# Altium project BMS.PrjPcb (part 1 of 2)
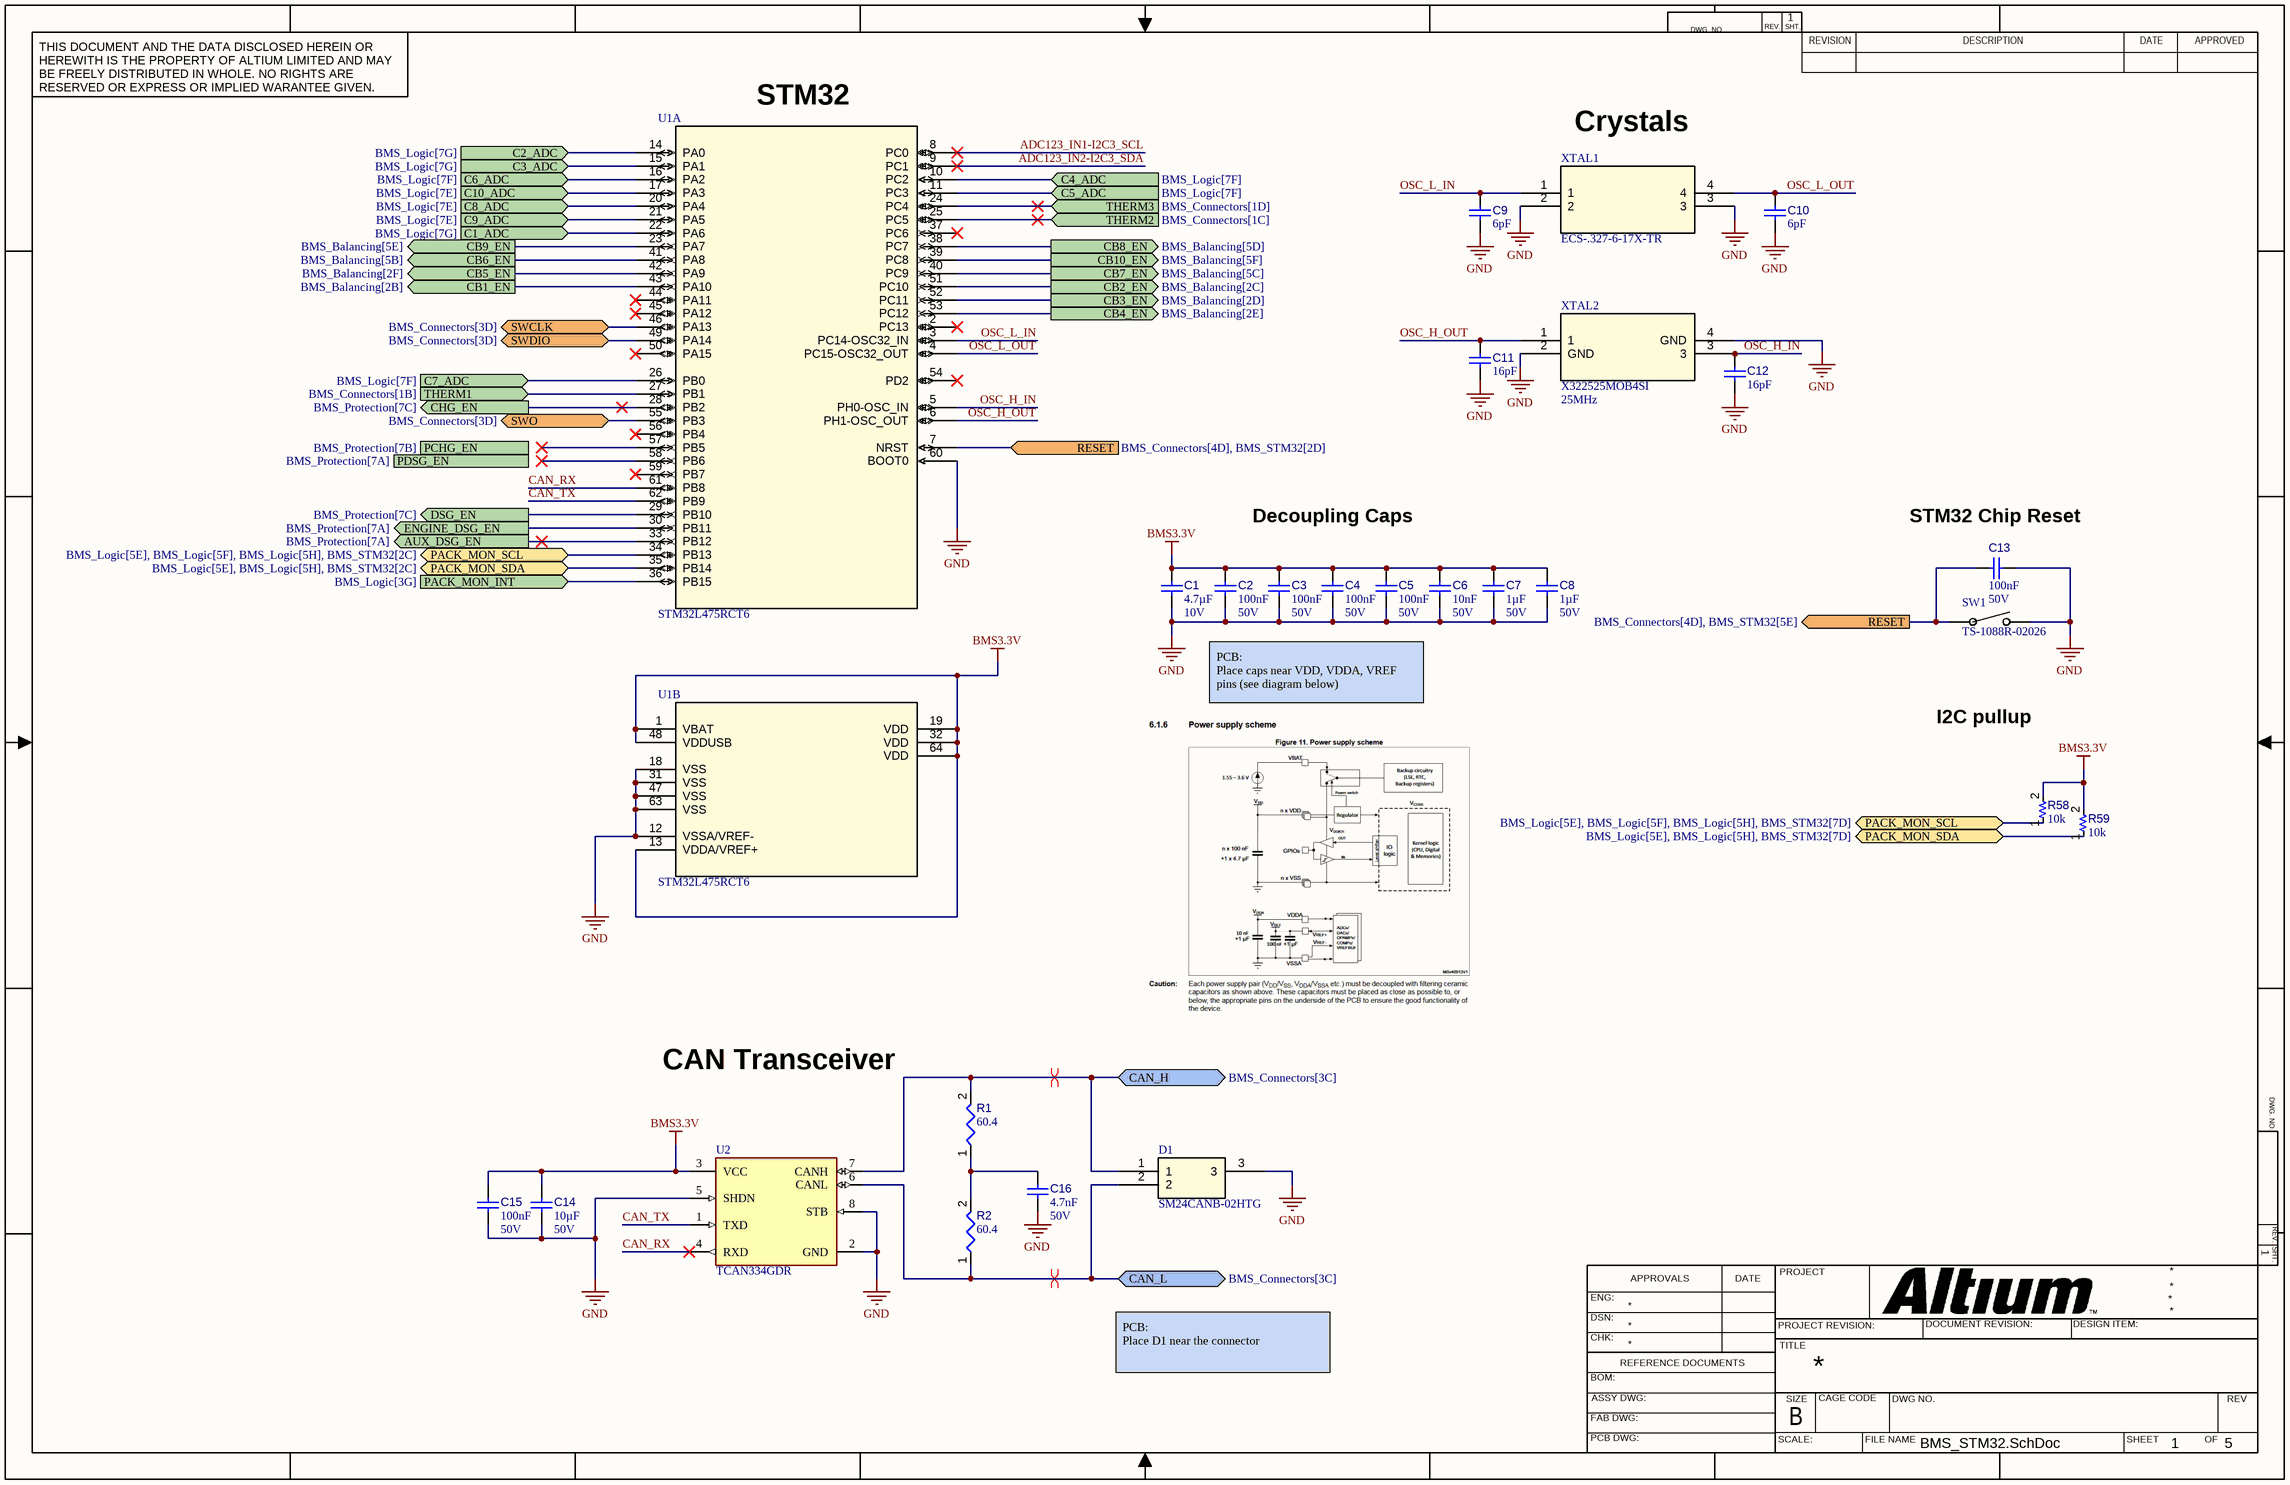
[diagram p0: BMS_STM32.SchDoc]
6 sheets, 209 parts. Net scope: flat (ports and power ports of the same name join across sheets).
Board file: BMS.PcbDoc
Sheets:
  BMS_STM32.SchDoc
  BMS_Connectors.SchDoc
  BMS_PowerRegulation.SchDoc
  BMS_Logic.SchDoc
  BMS_Balancing.SchDoc
  BMS_Protection.SchDoc

## Sheet BMS_STM32.SchDoc
size 431 x 279 mm; SheetNumber: 1; SheetTotal: 5

### Parts
C1  value 4.7µF  Voltage Rating: 10V  [CAPC0603(1608)100_L]  (hidden comment: Capacitor 4.7µF +/-20% 10V 0603)
C2  value 100nF  Voltage Rating: 50V  [CAPC0402(1005)60_L]  (hidden comment: Capacitor 100nF +/-20% 50V 0402)
C3  value 100nF  Voltage Rating: 50V  [CAPC0402(1005)60_L]  (hidden comment: Capacitor 100nF +/-20% 50V 0402)
C4  value 100nF  Voltage Rating: 50V  [CAPC0402(1005)60_L]  (hidden comment: Capacitor 100nF +/-20% 50V 0402)
C5  value 100nF  Voltage Rating: 50V  [CAPC0402(1005)60_L]  (hidden comment: Capacitor 100nF +/-20% 50V 0402)
C6  value 10nF  Voltage Rating: 50V  [CAPC0402(1005)60_L]  (hidden comment: Capacitor 10nF +/-20% 50V 0402)
C7  value 1µF  Voltage Rating: 50V  [CAPC0603(1608)100_L]  (hidden comment: Capacitor 1µF +/-40% 50V 0603)
C8  value 1µF  Voltage Rating: 50V  [CAPC0603(1608)100_L]  (hidden comment: Capacitor 1µF +/-40% 50V 0603)
C9  value 6pF  [CAPC1709X04N]  (hidden comment: Yageo CC0603CRNPO9BN6R0)
C10  value 6pF  [CAPC1709X04N]  (hidden comment: Yageo CC0603CRNPO9BN6R0)
C11  value 16pF  [CAPC1709X04N]  (hidden comment: Yageo CC0603JRNPO9BN160)
C12  value 16pF  [CAPC1709X04N]  (hidden comment: Yageo CC0603JRNPO9BN160)
C13  value 100nF  Voltage Rating: 50V  [CAPC0402(1005)60_L]  (hidden comment: Capacitor 100nF +/-20% 50V 0402)
C14  value 10µF  Voltage Rating: 50V  [CAPC0805(2012)145_L]  (hidden comment: Samsung Electro-Mechanics CL21A106KBYQNNE)
C15  value 100nF  Voltage Rating: 50V  [CAPC0402(1005)60_L]  (hidden comment: Capacitor 100nF +/-20% 50V 0402)
C16  value 4.7nF  Voltage Rating: 50V  [CAPC1709X04N]  (hidden comment: yageo CC0603KRX7R9BB472)
D1  SM24CANB-02HTG  [SOT23-3_SM24CANB-02HTG_LTF]
R1  value 60.4  [RESC1709X04N]  (hidden comment: yageo RC0603FR-0760R4L)
R2  value 60.4  [RESC1709X04N]  (hidden comment: yageo RC0603FR-0760R4L)
R58  value 10k  [RESC0402(1005)_L]  (hidden comment: RC0402FR-0710KL)
R59  value 10k  [RESC0402(1005)_L]  (hidden comment: RC0402FR-0710KL)
SW1  TS-1088R-02026  [SW_TS-1088R-02026_XNP]
U1  STM32L475RCT6  [LQFP64-10x10mm]  (parts A,B of 2)
U2  TCAN334GDR  [FP-D0008A-IPC_B]
XTAL1  ECS-.327-6-17X-TR  [XTAL_7X-TR_ECS]
XTAL2  X322525MOB4SI  Frequency: 25MHz  [SMT_MOB4SI_YXC]

### Ports
AUX_DSG_EN (out, see BMS_Protection[7A]), C1_ADC (in, see BMS_Logic[7G]), C2_ADC (in, see BMS_Logic[7G]), C3_ADC (in, see BMS_Logic[7G]), C4_ADC (in, see BMS_Logic[7F]), C5_ADC (in, see BMS_Logic[7F]), C6_ADC (in, see BMS_Logic[7F]), C7_ADC (in, see BMS_Logic[7F]), C8_ADC (in, see BMS_Logic[7E]), C9_ADC (in, see BMS_Logic[7E]), C10_ADC (in, see BMS_Logic[7E]), CAN_H (bidir, see BMS_Connectors[3C]), CAN_L (bidir, see BMS_Connectors[3C]), CB1_EN (out, see BMS_Balancing[2B]), CB2_EN (out, see BMS_Balancing[2C]), CB3_EN (out, see BMS_Balancing[2D]), CB4_EN (out, see BMS_Balancing[2E]), CB5_EN (out, see BMS_Balancing[2F]), CB6_EN (out, see BMS_Balancing[5B]), CB7_EN (out, see BMS_Balancing[5C]), CB8_EN (out, see BMS_Balancing[5D]), CB9_EN (out, see BMS_Balancing[5E]), CB10_EN (out, see BMS_Balancing[5F]), CHG_EN (out, see BMS_Protection[7C]), DSG_EN (out, see BMS_Protection[7C]), ENGINE_DSG_EN (out, see BMS_Protection[7A]), PACK_MON_INT (in, see BMS_Logic[3G]), PACK_MON_SCL (bidir, see BMS_Logic[5E], BMS_Logic[5F], BMS_Logic[5H], BMS_STM32[2C]), PACK_MON_SCL (bidir, see BMS_Logic[5E], BMS_Logic[5F], BMS_Logic[5H], BMS_STM32[7D]), PACK_MON_SDA (bidir, see BMS_Logic[5E], BMS_Logic[5H], BMS_STM32[2C]), PACK_MON_SDA (bidir, see BMS_Logic[5E], BMS_Logic[5H], BMS_STM32[7D]), PCHG_EN (out, see BMS_Protection[7B]), PDSG_EN (out, see BMS_Protection[7A]), RESET (in, see BMS_Connectors[4D], BMS_STM32[2D]), RESET (out, see BMS_Connectors[4D], BMS_STM32[5E]), SWCLK (bidir, see BMS_Connectors[3D]), SWDIO (bidir, see BMS_Connectors[3D]), SWO (bidir, see BMS_Connectors[3D]), THERM1 (in, see BMS_Connectors[1B]), THERM2 (in, see BMS_Connectors[1C]), THERM3 (in, see BMS_Connectors[1D])

### Nets
BMS3.3V: C1.1 C2.2 C3.2 C4.2 C5.2 C6.1 C7.1 C8.1 C14.1 C15.1 R58.2 R59.2 U1.1(VBAT) U1.13(VDDA/VREF+) U1.19(VDD) U1.32(VDD) U1.48(VDDUSB) U1.64(VDD) U2.3(VCC)
GND: C1.2 C2.1 C3.1 C4.1 C5.1 C6.2 C7.2 C8.2 C9.2 C10.2 C11.2 C12.1 C13.1 C14.2 C15.2 C16.2 D1.3 SW1.2 U1.12(VSSA/VREF-) U1.18(VSS) U1.31(VSS) U1.47(VSS) U1.60(BOOT0) U1.63(VSS) U2.2(GND) U2.5(SHDN) U2.8(STB) XTAL1.2 XTAL1.3 XTAL2.2(GND) XTAL2.4(GND)
ADC123_IN1-I2C3_SCL: U1.8(PC0)
ADC123_IN2-I2C3_SDA: U1.9(PC1)
AUX_DSG_EN: U1.33(PB12) ; port AUX_DSG_EN
C1_ADC: U1.22(PA6) ; port C1_ADC
C2_ADC: U1.14(PA0) ; port C2_ADC
C3_ADC: U1.15(PA1) ; port C3_ADC
C4_ADC: U1.10(PC2) ; port C4_ADC
C5_ADC: U1.11(PC3) ; port C5_ADC
C6_ADC: U1.16(PA2) ; port C6_ADC
C7_ADC: U1.26(PB0) ; port C7_ADC
C8_ADC: U1.20(PA4) ; port C8_ADC
C9_ADC: U1.21(PA5) ; port C9_ADC
C10_ADC: U1.17(PA3) ; port C10_ADC
CAN_H: D1.1 R1.2 U2.7(CANH) ; port CAN_H
CAN_L: D1.2 R2.1 U2.6(CANL) ; port CAN_L
CAN_RX: U1.61(PB8) U2.4(RXD)
CAN_TX: U1.62(PB9) U2.1(TXD)
CB1_EN: U1.43(PA10) ; port CB1_EN
CB2_EN: U1.51(PC10) ; port CB2_EN
CB3_EN: U1.52(PC11) ; port CB3_EN
CB4_EN: U1.53(PC12) ; port CB4_EN
CB5_EN: U1.42(PA9) ; port CB5_EN
CB6_EN: U1.41(PA8) ; port CB6_EN
CB7_EN: U1.40(PC9) ; port CB7_EN
CB8_EN: U1.38(PC7) ; port CB8_EN
CB9_EN: U1.23(PA7) ; port CB9_EN
CB10_EN: U1.39(PC8) ; port CB10_EN
CHG_EN: U1.28(PB2) ; port CHG_EN
DSG_EN: U1.29(PB10) ; port DSG_EN
ENGINE_DSG_EN: U1.30(PB11) ; port ENGINE_DSG_EN
OSC_H_IN: C12.2 U1.5(PH0-OSC_IN) XTAL2.3
OSC_H_OUT: C11.1 U1.6(PH1-OSC_OUT) XTAL2.1
OSC_L_IN: C9.1 U1.3(PC14-OSC32_IN) XTAL1.1
OSC_L_OUT: C10.1 U1.4(PC15-OSC32_OUT) XTAL1.4
PACK_MON_INT: U1.36(PB15) ; port PACK_MON_INT
PACK_MON_SCL: R58.1 U1.34(PB13) ; port PACK_MON_SCL
PACK_MON_SDA: R59.1 U1.35(PB14) ; port PACK_MON_SDA
RESET: C13.2 SW1.1 U1.7(NRST) ; port RESET
SWCLK: U1.46(PA13) ; port SWCLK
SWDIO: U1.49(PA14) ; port SWDIO
SWO: U1.55(PB3) ; port SWO
THERM1: U1.27(PB1) ; port THERM1
THERM2: U1.25(PC5) ; port THERM2
THERM3: U1.24(PC4) ; port THERM3
NetC16_1: C16.1 R1.1 R2.2

Not connected (* = marked no-connect by the designer): U1 2(PC13)* 37(PC6)* 44(PA11)* 45(PA12)* 50(PA15)* 54(PD2)* 56(PB4)* 57(PB5)* 58(PB6)* 59(PB7)*

### Layout directives
differential pair: CAN_H, CAN_L

### Notes on the sheet
- (near U1) STM32
- Crystals
- Decoupling Caps
- (near C13) STM32 Chip Reset
- PCB:
  Place caps near VDD, VDDA, VREF pins (see diagram below)
- I2C pullup
- CAN Transceiver
- PCB:
  Place D1 near the connector
- DWG. NO.
- REV.
- SHT.
- THIS DOCUMENT AND THE DATA DISCLOSED HEREIN OR HEREWITH IS THE PROPERTY OF ALTIUM LIMITED AND MAY BE FREELY DISTRIBUTED IN WHOLE. NO RIGHTS ARE RESERVED OR EXPRESS OR IMPLIED WARANTEE GIVEN.
- REVISION
- DESCRIPTION
- DATE
- APPROVED
- ENG:
- APPROVALS
- PROJECT
- DSN:
- CHK:
- REFERENCE DOCUMENTS
- PROJECT REVISION:
- TITLE
- DOCUMENT REVISION:
- DESIGN ITEM:
- BOM:
- FAB DWG:
- PCB DWG:
- ASSY DWG:
- SCALE:
- SIZE
- B
- CAGE CODE
- FILE NAME
- DWG NO.
- SHEET
- OF
- REV

### Library data of the parts
C1 = CMP-001-00076-4: Chip Capacitor, 4.7µF +/-20%, 10V, 0603, Thickness 1 mm; Tolerance: 10%; Mounting Technology: SMT; Case/Package: 0603; Pins: 2; Min Operating Temperature: -55°C; Max Operating Temperature: 85°C
C2-C5 C13 C15 = CMP-001-00067-3: Chip Capacitor, 100nF +/-20%, 50V, 0402, Thickness 0.6 mm; Tolerance: 10%; Min Operating Temperature: -55°C; Pins: 2; Case/Package: 0402; Max Operating Temperature: 85°C; Mounting Technology: SMT
C6 = CMP-001-00069-3: Chip Capacitor, 10nF +/-20%, 50V, 0402, Thickness 0.6 mm; Tolerance: 5%; Max Operating Temperature: 85°C; Pins: 2; Case/Package: 0402; Min Operating Temperature: -55°C; Mounting Technology: SMT
C7 C8 = CMP-001-00078-4: Chip Capacitor, 1µF +/-40%, 50V, 0603, Thickness 1 mm; Tolerance: 10%; Case/Package: 0603; Pins: 2; Max Operating Temperature: 85°C; Mounting Technology: SMT; Min Operating Temperature: -55°C
C9 C10 = CMP-001-00085-2: Ceramic Capacitor, Multilayer, Ceramic, 50V, 4.17% +Tol, 4.17% -Tol, C0G, -/+30ppm/Cel TC, 0.000006uF, Surface Mount, 0603; Pins: 2; Capacitor Type: Ceramic; Case/Package: 0603; Mounting Technology: Surface Mount; RoHS Compliant: Yes; Min Operating Temperature: -55°C; Max Operating Temperature: 125°C
C11 C12 = CMP-001-00087-3: Multilayer Ceramic Capacitor, 16 pF, 50 V, ± 5%, C0G (NP0), 0603 [1608 Metric]
C14 = CMP-001-00079-4: Chip Capacitor, 10µF +/-20%, 25V, 0805, Thickness 1.45 mm; Tolerance: 10%; Max Operating Temperature: 85°C; Case/Package: 0805; Min Operating Temperature: -55°C; Mounting Technology: SMT; Pins: 2
C16 = CMP-001-00083-3: Ceramic Capacitor, Multilayer, Ceramic, 50V, 10% +Tol, 10% -Tol, X7R, 15% TC, 0.0047uF, Surface Mount, 0603; Max Operating Temperature: 125°C; RoHS Compliant: Yes; Case/Package: 0603; Mounting Technology: Surface Mount; Pins: 2; Capacitor Type: Ceramic; Min Operating Temperature: -55°C
D1 = CMP-054-000000-3: No Description Available; Manufacturer_Name: Littelfuse Inc; Source: SM24CANB-02HTG.SchLib; Manufacturer_Part_Number: SM24CANB-02HTG; Design Item ID: SM24CANB-02HTG; RefDes: RefDes; Copyright: Copyright (C) 2025 Ultra Librarian. All rights reserved.; Type: Type
R1 R2 = CMP-009-00177-3: Fixed Resistor, Metal Glaze/thick Film, 0.1W, 60.4ohm, 75V, 1% +/-Tol, 100ppm/Cel, Surface Mount, 0603; Power: 100mW; Max Operating Temperature: 155°C; Pins: 2; Tolerance: 1%; RoHS Compliant: Yes; Min Operating Temperature: -55°C; Mounting Technology: Surface Mount; Case/Package: 0603
R58 R59 = CMP-009-00065-4: 100R 0.063W 1% 0402 (1005 Metric)  SMD; Power: 63mW; Mounting Technology: SMT; Case/Package: 0402; Pins: 2; Tolerance: 1%
SW1 = CMP-011-00013-1: No Description Available; Manufacturer_Name: Xunpu; Design Item ID: TS-1088R-02026; Copyright: Copyright (C) 2025 Ultra Librarian. All rights reserved.; Manufacturer_Part_Number: TS-1088R-02026; Type: Tactile Switches; Source: TS-1088R-02026.SchLib
U1 = CMP-031-00008-2: Ultra-low-power with FPU Arm Cortex-M4 MCU 80 MHz with 256 Kbytes of Flash memory, USB OTG, DFSDM; Manufacturer_Name: STMicroelectronics; Design Item ID: STM32L475RCT6; Manufacturer_Part_Number: STM32L475RCT6; Source: STM32L475RCT6.SchLib; RefDes: RefDes; Copyright: Copyright (C) 2025 Ultra Librarian. All rights reserved.; Type: Type; Datasheet: https://www.st.com/resource/en/datasheet/stm32l475rc.pdf; RoHS Compliant: Yes
U2 = CMP-015-00009-1: Interface Circuit, PDSO8; Nominal Supply Voltage: 3.3V; Min Operating Temperature: -40°C; RoHS Compliant: Yes; Max Operating Temperature: 125°C; Pins: 8; Case/Package: SOP
XTAL1 = CMP-036-000000-1: No Description Available; Manufacturer_Name: ECS International; Copyright: Copyright (C) 2025 Ultra Librarian. All rights reserved.; Manufacturer_Part_Number: ECS-.327-6-17X-TR; Design Item ID: ECS-.327-6-17X-TR; Source: ECS-P327-6-17X-TR.SchLib; RefDes: RefDes; Type: Type
XTAL2 = CMP-039-000000-5: No Description Available; Manufacturer_Name: YXC; Design Item ID: X322525MOB4SI; Copyright: Copyright (C) 2025 Ultra Librarian. All rights reserved.; Source: X322525MOB4SI.SchLib; Type: Type; RefDes: RefDes; Manufacturer_Part_Number: X322525MOB4SI

## Sheet BMS_Connectors.SchDoc: Connectors
size A4; SheetNumber: 2; SheetTotal: 5
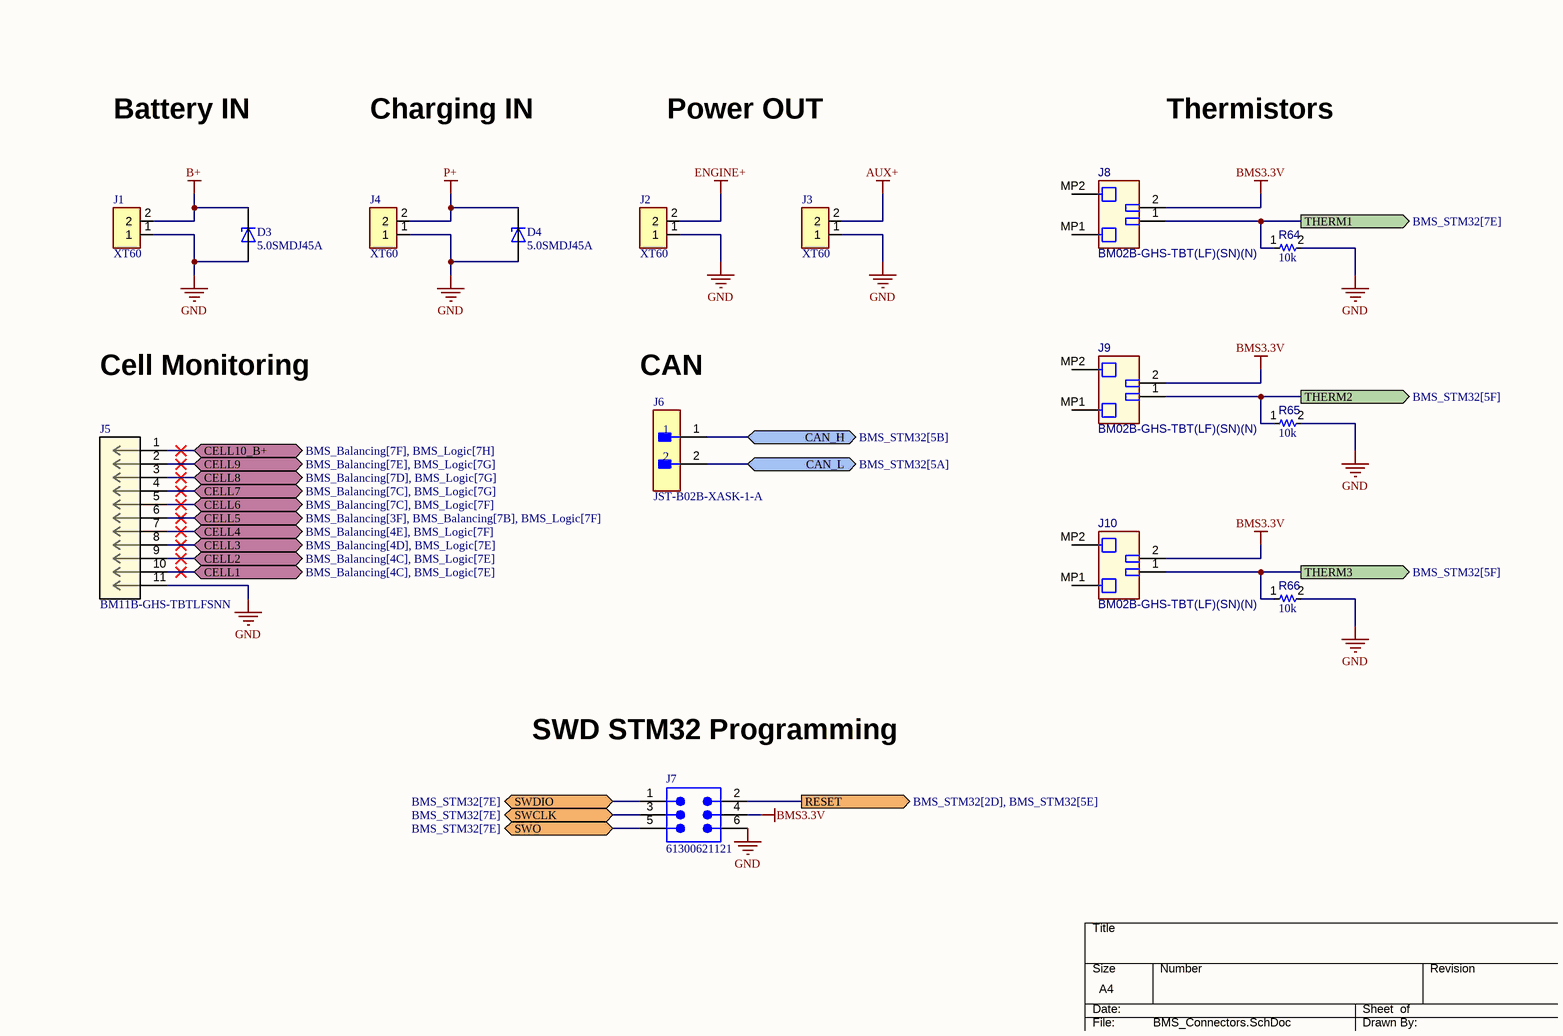
[diagram p1: BMS_Connectors.SchDoc]

### Parts
D3  5.0SMDJ45A  [DIOM7959X262N]
D4  5.0SMDJ45A  [DIOM7959X262N]
J1  XT60  [AMASS_XT60PB-M]
J2  XT60  [AMASS_XT60PB-M]
J3  XT60  [AMASS_XT60PB-M]
J4  XT60  [AMASS_XT60PB-M]
J5  BM11B-GHS-TBTLFSNN  [CONN11_BM11B-GHS-TBTLFSNN_JST]
J6  JST-B02B-XASK-1-A  [FP-B02B-XASK-1-A_LF_SN-MFG]
J7  61300621121  [61300621121]
J8  BM02B-GHS-TBT(LF)(SN)(N)  [JST-BM02B-GHS-TBT_V]
J9  BM02B-GHS-TBT(LF)(SN)(N)  [JST-BM02B-GHS-TBT_V]
J10  BM02B-GHS-TBT(LF)(SN)(N)  [JST-BM02B-GHS-TBT_V]
R64  value 10k  [RESC0402(1005)_L]  (hidden comment: RC0402FR-0710KL)
R65  value 10k  [RESC0402(1005)_L]  (hidden comment: RC0402FR-0710KL)
R66  value 10k  [RESC0402(1005)_L]  (hidden comment: RC0402FR-0710KL)

### Ports
CAN_H (bidir, see BMS_STM32[5B]), CAN_L (bidir, see BMS_STM32[5A]), CELL1 (bidir, see BMS_Balancing[4C], BMS_Logic[7E]), CELL2 (bidir, see BMS_Balancing[4C], BMS_Logic[7E]), CELL3 (bidir, see BMS_Balancing[4D], BMS_Logic[7E]), CELL4 (bidir, see BMS_Balancing[4E], BMS_Logic[7F]), CELL5 (bidir, see BMS_Balancing[3F], BMS_Balancing[7B], BMS_Logic[7F]), CELL6 (bidir, see BMS_Balancing[7C], BMS_Logic[7F]), CELL7 (bidir, see BMS_Balancing[7C], BMS_Logic[7G]), CELL8 (bidir, see BMS_Balancing[7D], BMS_Logic[7G]), CELL9 (bidir, see BMS_Balancing[7E], BMS_Logic[7G]), CELL10_B+ (bidir, see BMS_Balancing[7F], BMS_Logic[7H]), RESET (out, see BMS_STM32[2D], BMS_STM32[5E]), SWCLK (bidir, see BMS_STM32[7E]), SWDIO (bidir, see BMS_STM32[7E]), SWO (bidir, see BMS_STM32[7E]), THERM1 (out, see BMS_STM32[7E]), THERM2 (out, see BMS_STM32[5F]), THERM3 (out, see BMS_STM32[5F])

### Nets
AUX+: J3.2
B+: D3.C J1.2 J5.1 ; port CELL10_B+
BMS3.3V: J7.4 J8.2 J9.2 J10.2
ENGINE+: J2.2
GND: D3.A D4.A J1.1 J2.1 J3.1 J4.1 J5.11 J7.6 R64.2 R65.2 R66.2
P+: D4.C J4.2
CAN_H: J6.1 ; port CAN_H
CAN_L: J6.2 ; port CAN_L
CELL1: J5.10 ; port CELL1
CELL2: J5.9 ; port CELL2
CELL3: J5.8 ; port CELL3
CELL4: J5.7 ; port CELL4
CELL5: J5.6 ; port CELL5
CELL6: J5.5 ; port CELL6
CELL7: J5.4 ; port CELL7
CELL8: J5.3 ; port CELL8
CELL9: J5.2 ; port CELL9
RESET: J7.2 ; port RESET
SWCLK: J7.3 ; port SWCLK
SWDIO: J7.1 ; port SWDIO
SWO: J7.5 ; port SWO
THERM1: J8.1 R64.1 ; port THERM1
THERM2: J9.1 R65.1 ; port THERM2
THERM3: J10.1 R66.1 ; port THERM3

Not connected (* = marked no-connect by the designer): J8 MP1 MP2; J9 MP1 MP2; J10 MP1 MP2

### Notes on the sheet
- Battery IN
- Charging IN
- Power OUT
- Thermistors
- Cell Monitoring
- CAN
- SWD STM32 Programming
- DWG NO:
- REV:
- THIS DOCUMENT AND THE DATA DISCLOSED HEREIN OR
- HEREWITH IS THE PROPERTY OF ALTIUM LIMITED AND MAY
- BE FREELY DISTRIBUTED IN WHOLE. NO RIGHTS ARE
- RESERVED OR EXPRESS OR IMPLIED WARANTEE GIVEN.
- REVISION
- DESCRIPTION
- DATE
- APPROVED
- ENG:
- APPROVALS
- PROJECT
- DSN:
- CHK:
- REFERENCE DOCUMENTS
- PROJECT REVISION:
- TITLE
- DOCUMENT REVISION:
- DESIGN ITEM:
- BOM:
- FAB DWG:
- PCB DWG:
- ASSY DWG:
- SCALE:
- A2
- SIZE
- CAGE CODE
- FILE NAME
- DWG NO.
- SHEET
- OF
- REV

### Library data of the parts
D3 D4 = CMP-004-00034-2: 8.0SMDJ43CA-T7, Uni-Directional TVS Diode, 8000W, 2-Pin DO-214AB; MP: SMCJ48A; MF: Littelfuse Inc.; Design Item ID: 8.0SMDJ43CA-T7; SnapEDA_Link: https://www.snapeda.com/parts/SMCJ48A/Littelfuse/view-part/?ref=snap; Source: 8.0SMDJ43CA-T7.SchLib; Case/Package: DO-214 Littelfuse Inc.; Check_prices: https://www.snapeda.com/parts/SMCJ48A/Littelfuse/view-part/?ref=eda; Value: *
J1-J4 = CMP-011-000000-3: Power connector; 65A; PIN: 2; Colour: yellow; MF: Pololu; MP: XT60 YELLOW; Package: None; Availability: Not in stock; Check_prices: https://www.snapeda.com/parts/XT60%20YELLOW/Pololu/view-part/?ref=eda; Source: XT60_YELLOW.SchLib; Component Type: Standard; Value: *; SnapEDA_Link: https://www.snapeda.com/parts/XT60%20YELLOW/Pololu/view-part/?ref=snap; Price: None; Pin Count: 2; Design Item ID: XT60_YELLOW
J5 = CMP-168-000000-2: No Description Available; Manufacturer_Part_Number: BM11B-GHS-TBT(LF)(SN)(N); Manufacturer_Name: JST; RefDes: RefDes; Copyright: Copyright (C) 2025 Ultra Librarian. All rights reserved.; Design Item ID: BM11B-GHS-TBTLFSNN; Source: BM11B-GHS-TBTLFSNN.SchLib; Type: Type
J6 = CMP-002-00073-2: XA Series 2 Position 2.5mm Pitch Top Entry with Boss ThroughHole Shrouded Header
J7 = CMP-002-00076-2: WR-PHD Pin Header, THT, Vertical, pitch 2.54mm, 2 Row, 6P; Manufacturer: Wurth Elektronik; Contact Resistance: 20mOhm; Withstanding Voltage: 500V; Working Voltage: 250V; Rated Current: 3A; ComponentLink2URL: https://www.we-online.com/redexpert/spec/61300621121?ad; Operating Temperature Max: 105°C; Operating Temperature Min: -40°C; Match Code: WR-PHD; Pins: 6; Source: WR-PHD.SchLib; ComponentLink1URL: https://www.we-online.com/redexpert/article/61300621121?ad; Mount: Through Hole; Design Item ID: 61300621121; Orientation: Vertical; Manufacturer Part Number: 61300621121; Category: Board-to-Board Connectors; Pitch: 2.54mm; ComponentLink2Description: Datasheet Link; Packaging: Bag; Gender: Pin Header; ComponentLink1Description: Website Link; Pin Count: 6; Component Type: Standard; Number of Rows: 2
J8-J10 = CMP-002-00061-3: Disconnectable Crimp Style Connector, Pitch 1.25 mm, 1 x 2 Position, Height 4.05 mm, -25 to 85 degC, RoHS, Tape and Reel; Connector Type: Header,Shrouded; Mounting Technology: SurfaceMount; Case/Package: Disconnectable Crimp Style Connector, Pitch 1.25 mm, 1 x 2 Position, Height 4.05 mm; Pins: 4
R64-R66 = CMP-009-00065-4: as R58 on sheet BMS_STM32; Mounting Technology: SMT; Case/Package: 0402; Pins: 2; Tolerance: 1%

## Sheet BMS_PowerRegulation.SchDoc
size 431 x 279 mm; SheetNumber: 3; SheetTotal: 5
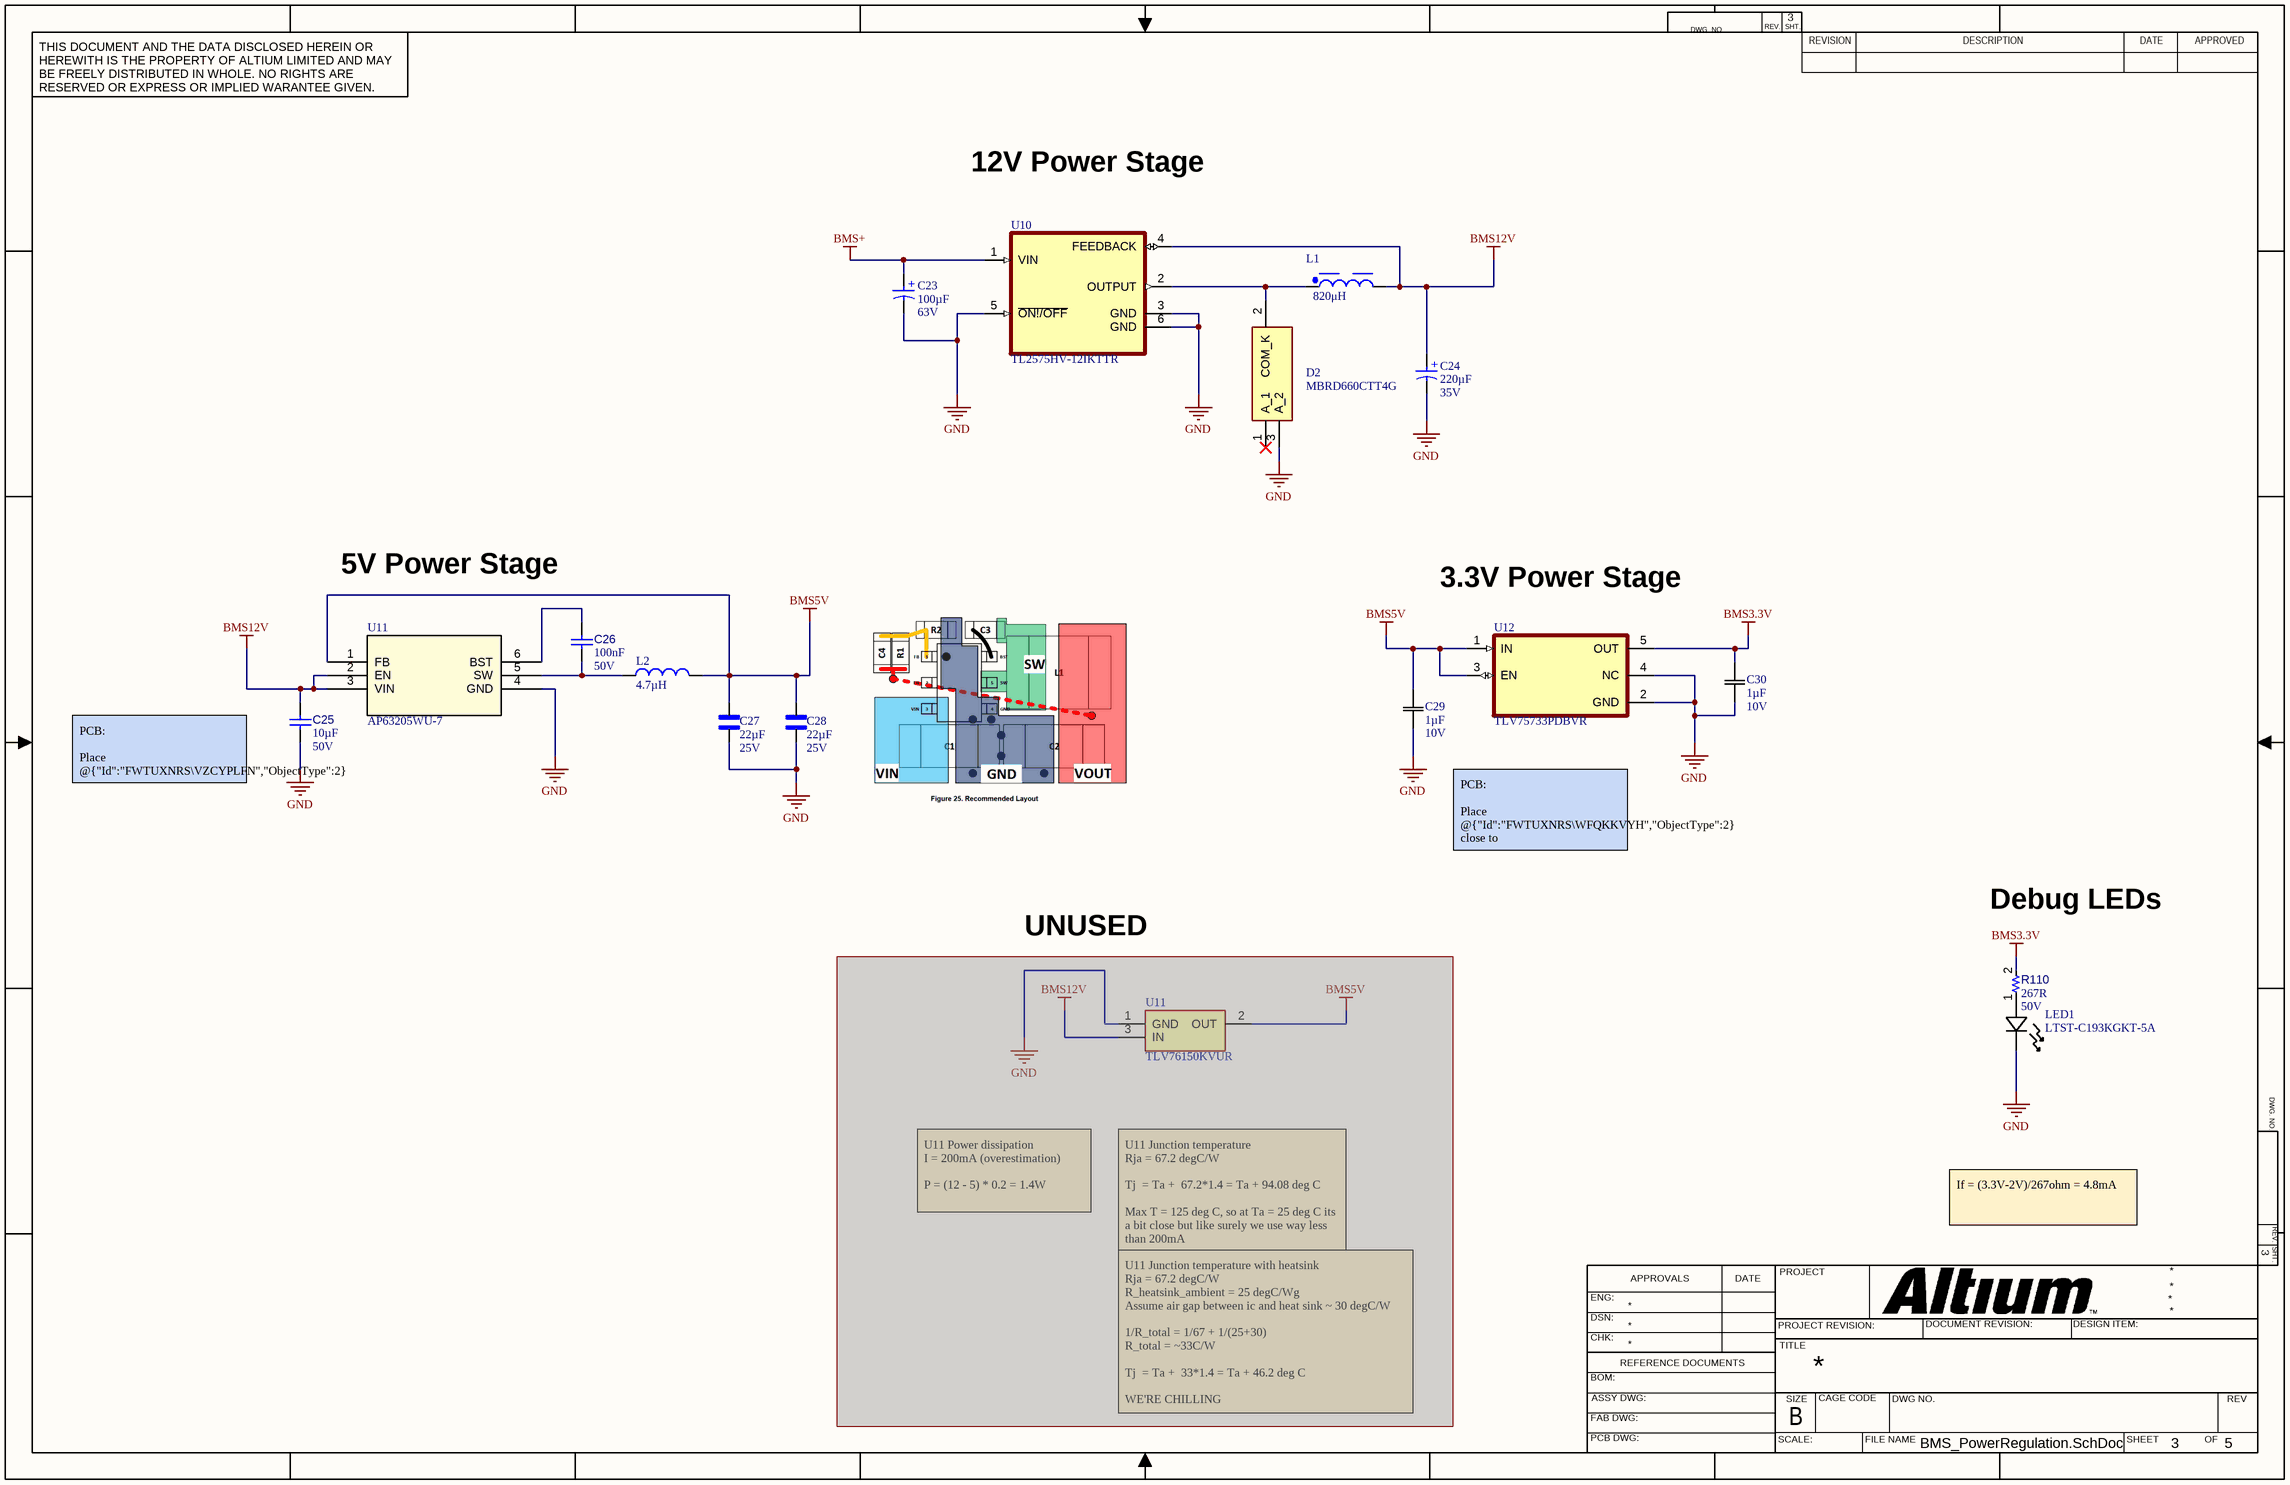
[diagram p2: BMS_PowerRegulation.SchDoc]

### Parts
(Parts that share a designator on the sheet are numbered #1, #2 ... from top to bottom, then left to right.)
C23  value 100µF  Rated Voltage (DC): 63V  [WCAP-ASLI_D10H10.5]  (hidden comment: 865080757014)
C24  value 220µF  Rated Voltage (DC): 35V  [WCAP-ASLI_D8H10.5]  (hidden comment: 865080553014)
C25  value 10µF  Voltage Rating: 50V  [CAPC0805(2012)145_L]  (hidden comment: Samsung Electro-Mechanics CL21A106KBYQNNE)
C26  value 100nF  Voltage Rating: 50V  [CAPC0402(1005)60_L]  (hidden comment: Capacitor 100nF +/-20% 50V 0402)
C27  value 22µF  Voltage Rating: 25V  [CAPC2012X145N]  (hidden comment: CL21A226MAYNNNE)
C28  value 22µF  Voltage Rating: 25V  [CAPC2012X145N]  (hidden comment: CL21A226MAYNNNE)
C29  value 1µF  Voltage Rating: 10V  [CAP_CL10_SAM]  (hidden comment: CL10B105KP8NNNC)
C30  value 1µF  Voltage Rating: 10V  [CAP_CL10_SAM]  (hidden comment: CL10B105KP8NNNC)
D2  MBRD660CTT4G  [MBRD660CTT4G]
L1  Inductance: 820μH  [WE-PD_1210]  (hidden comment: 7447709821 820uH)
L2  value 4.7µH  [INDC2520X100N]  (hidden comment: LQM2HPN4R7MG0L)
LED1  LTST-C193KGKT-5A  [LED_LTST-C194K-0603_1P6X0P8X0P3_LTO]
R110  value 267R  Voltage Rating: 50V  [RESC0402(1005)_L]  (hidden comment: RT0402BRD07267RL)
U10  TL2575HV-12IKTTR  [VREG_TPS79625KTTR]
U11#1  AP63205WU-7  [SOIC_05WU-7_DIO]
U11#2  TLV76150KVUR  [TLV76150KVUR_WithHeatsink]  (masked out: inside a compile mask, not in the netlist)
U12  TLV75733PDBVR  [SOT95P280X145-5N]

### Nets
BMS3.3V: C30.2 R110.2 U12.5(OUT)
BMS5V: C27.2 C28.2 C29.2 L2.2 U11#1.1(FB) U12.1(IN) U12.3(EN)
BMS12V: C24.1(P) C25.1 L1.2 U10.4(FEEDBACK) U11#1.2(EN) U11#1.3(VIN)
BMS+: C23.1(P) U10.1(VIN)
GND: C23.2(N) C24.2(N) C25.2 C27.1 C28.1 C29.1 C30.1 D2.3(A_2) LED1.1 U10.3(GND) U10.5(~{ON!/OFF}) U10.6(GND) U11#1.4(GND) U12.2(GND) U12.4(NC)
NetC26_1: C26.1 L2.1 U11#1.5(SW)
NetC26_2: C26.2 U11#1.6(BST)
NetD2_2: D2.2(COM_K) L1.1 U10.2(OUTPUT)
NetLED1_2: LED1.2 R110.1

Not connected (* = marked no-connect by the designer): D2 1(A_1)*

### Notes on the sheet
- 12V Power Stage
- 5V Power Stage
- 3.3V Power Stage
- PCB:
  Place @{"Id":"FWTUXNRS\VZCYPLFN","ObjectType":2} close to @{"Id":"FWTUXNRS\CUETEAYZ","ObjectType":2} pin 3
- PCB:
  Place @{"Id":"FWTUXNRS\WFQKKVYH","ObjectType":2} close to @{"Id":"FWTUXNRS\HPDKJLBX","ObjectType":2} pin 1
  Place @{"Id":"FWTUXNRS\TOYSBIWG","ObjectType":2} close to @{"Id":"FWTUXNRS\HPDKJLBX","ObjectType":2} pin 5
- UNUSED
- Debug LEDs
- U11 Power dissipation
  I = 200mA (overestimation)
  P = (12 - 5) * 0.2 = 1.4W
- If = (3.3V-2V)/267ohm = 4.8mA
- U11 Junction temperature
  Rja = 67.2 degC/W
  Tj  = Ta +  67.2*1.4 = Ta + 94.08 deg C
  Max T = 125 deg C, so at Ta = 25 deg C its a bit close but like surely we use way less than 200mA
- U11 Junction temperature with heatsink
  Rja = 67.2 degC/W
  R_heatsink_ambient = 25 degC/Wg
  Assume air gap between ic and heat sink ~ 30 degC/W
  1/R_total = 1/67 + 1/(25+30)
  R_total = ~33C/W
  Tj  = Ta +  33*1.4 = Ta + 46.2 deg C
  WE'RE CHILLING
- DWG. NO.
- REV.
- SHT.
- THIS DOCUMENT AND THE DATA DISCLOSED HEREIN OR HEREWITH IS THE PROPERTY OF ALTIUM LIMITED AND MAY BE FREELY DISTRIBUTED IN WHOLE. NO RIGHTS ARE RESERVED OR EXPRESS OR IMPLIED WARANTEE GIVEN.
- REVISION
- DESCRIPTION
- DATE
- APPROVED
- ENG:
- APPROVALS
- PROJECT
- DSN:
- CHK:
- REFERENCE DOCUMENTS
- PROJECT REVISION:
- TITLE
- DOCUMENT REVISION:
- DESIGN ITEM:
- BOM:
- FAB DWG:
- PCB DWG:
- ASSY DWG:
- SCALE:
- SIZE
- B
- CAGE CODE
- FILE NAME
- DWG NO.
- SHEET
- OF
- REV
- (in symbol CMP-001-00090-1) +
- (in symbol CMP-001-00091-1) +

### Library data of the parts
C23 = CMP-001-00091-1: WCAP-ASLI Aluminum Electrolytic Capacitor, V-Chip, D10 x H10.5mm, 100uF, 63V; Manufacturer: Wurth Elektronik; Technical Reference: ASEF105101M063DVCTEB000; Dissipation Factor: 12%; Leakage Current: 63uA; Ripple Current: 280mA; Endurance: 2000h; Capacitance Tolerance: +/-20%; ComponentLink2URL: https://www.we-online.com/redexpert/spec/865080757014?ad; Diameter: 10mm; ComponentLink2Description: Datasheet Link; Source: WCAP-ASLI.SchLib; Match Code: WCAP-ASLI; Manufacturer Part Number: 865080757014; Mount: Surface Mount; ComponentLink1URL: https://www.we-online.com/redexpert/article/865080757014?ad; Operating Temperature Max: 105°C; Design Item ID: 865080757014; Height: 10.5mm; Operating Temperature Min: -55°C; Packaging: Tape and Reel; Category: Aluminum Electrolytic Capacitors; ComponentLink1Description: Website Link
C24 = CMP-001-00090-1: WCAP-ASLI Aluminum Electrolytic Capacitor, V-Chip, D8 x H10.5mm, 220uF, 35V; Manufacturer: Wurth Elektronik; Ripple Current: 570mA; Endurance: 2000h; Dissipation Factor: 14%; Technical Reference: ASEE105221M035DVCTEB000; Capacitance Tolerance: +/-20%; Leakage Current: 77uA; Packaging: Tape and Reel; Category: Aluminum Electrolytic Capacitors; ComponentLink1URL: https://www.we-online.com/redexpert/article/865080553014?ad; Diameter: 8mm; ComponentLink2URL: https://www.we-online.com/redexpert/spec/865080553014?ad; Height: 10.5mm; Source: WCAP-ASLI.SchLib; Operating Temperature Min: -55°C; Operating Temperature Max: 105°C; Design Item ID: 865080553014; ComponentLink2Description: Datasheet Link; Match Code: WCAP-ASLI; Mount: Surface Mount; Manufacturer Part Number: 865080553014; ComponentLink1Description: Website Link
C25 = CMP-001-00079-4: as C14 on sheet BMS_STM32; Max Operating Temperature: 85°C; Case/Package: 0805; Min Operating Temperature: -55°C; Mounting Technology: SMT; Pins: 2
C26 = CMP-001-00067-3: as C2 on sheet BMS_STM32; Min Operating Temperature: -55°C; Pins: 2; Case/Package: 0402; Max Operating Temperature: 85°C; Mounting Technology: SMT
C27 C28 = CMP-001-00092-3: MF: {'manufacturer': u'Samsung Electro-Mechanics'}; Price: None; Availability: Unavailable; Case/Package: None; Design Item ID: CL21A226MAYNNNE; Source: CL21A226MAYNNNE.SchLib; MP: CL21A226MAYNNNE
C29 C30 = CMP-001-00095-3: No Description Available; Manufacturer_Name: Samsung; Manufacturer_Part_Number: CL10B105KP8NNNC; Design Item ID: CL10B105KP8NNNC; Copyright: Copyright (C) 2025 Ultra Librarian. All rights reserved.; Source: CL10B105KP8NNNC.SchLib
D2 = CMP-004-00031-3: Rectifier Diode, Schottky, 1 Phase, 2 Element, 3A, 60V V(RRM), Silicon; Manufacturer_Name: onsemi; Geometry.Height: 2.51mm; Forward Voltage: 650mV; Pins: 2; Manufacturer_Part_Number: MBRD660CTT4G; Source: MBRD660CTT4G.SchLib; RoHS Compliant: Yes; Datasheet Link: https://www.onsemi.com/pub/Collateral/MBRD620CT-D.PDF; Forward Current: 3A; Case/Package: DPAK3 6.10x6.54x2.28, 2.29P; Peak Inverse Voltage: 60V; Min Operating Temperature: -65°C; Mouser Price/Stock: https://www.mouser.co.uk/ProductDetail/onsemi/MBRD660CTT4G?qs=3JMERSakebo2QxKE182ubQ%3D%3D; Max Operating Temperature: 175°C; Design Item ID: MBRD660CTT4G
L1 = CMP-006-00021-1: WE-PD SMT Power Inductor, size 1210, 820μH, 0.95A, 1000mΩ; Manufacturer: Wurth Elektronik; Saturation Current: 1.1A; DC Resistance: 815mΩ; Self Resonant Frequency: 1.2MHz; Type: Standard; Min Operating Temperature: -40°C; Case/Package: 1210; Length: 12mm; ComponentLink2URL: https://www.we-online.com/redexpert/spec/7447709821?ad; Match Code: WE-PD; Max Operating Temperature: 125°C; Design Item ID: 7447709821; ComponentLink2Description: Datasheet Link; Mount: Surface Mount; ComponentLink1URL: https://www.we-online.com/redexpert/article/7447709821?ad; DC Resistance Max: 1000mΩ; Source: WE-PD.SchLib; Rated Current: 0.95A; Manufacturer Part Number: 7447709821; Width: 12mm; Packaging: Tape and Reel; Height: 10mm; ComponentLink1Description: Website Link; Category: Power Inductors
L2 = CMP-006-00023-3: Inductor with Inductance: 4.7uH Tol. +/-20%, Package: 1008 _2520_; MF: Murata Electronics; Source: SnapEDAsch.SchLib; Availability: Unavailable; SnapEDA_Link: https://www.snapeda.com/parts/LQM2HPN4R7MG0L/Murata%20Electronics%20North%20America/view-part/210541/?ref=snap; Design Item ID: LQM2HPN4R7MG0L; Case/Package: 2520 Murata; Price: None; MP: LQM2HPN4R7MG0L
LED1 = CMP-007-00036-3: No Description Available; Manufacturer_Name: LITE-ON; Type: LED Indication; Source: LTST-C194KGKT.SchLib; Manufacturer_Part_Number: LTST-C194KGKT; Design Item ID: LTST-C194KGKT; Copyright: Copyright (C) 2025 Ultra Librarian. All rights reserved.
R110 = CMP-009-00065-4: as R58 on sheet BMS_STM32; Mounting Technology: SMT; Case/Package: 0402; Pins: 2; Tolerance: 1%
U10 = CMP-063-000000-4: Switching Regulator, Voltage-mode, 4A, 58kHz Switching Freq-Max, PSSO5; Max Supply Voltage: 60V; Output Current: 1A; Frequency: 52kHz; Feedback Bias Current: 500nA; Min Supply Voltage: 4.75V; Output Voltage: 12V; Max frequency: 63kHz; Design Item ID: TL2575HV-12IKTTR; Case/Package: TO-263; Source: TL2575HV-12IKTTR.SchLib; MP: TL2575HV-12IKTTR; Pins: 5; Price: None; Pin Count: 6; Value: *; Component Type: Standard; Package: None; Max Operating Temperature: 125°C; RoHS Compliant: Yes; Min Operating Temperature: -40°C
U11#1 = CMP-075-000000-2: No Description Available; Manufacturer_Name: Diodes Inc; Manufacturer_Part_Number: AP63205WU-7; Type: Type; Source: AP63205WU-7.SchLib; RefDes: RefDes; Copyright: Copyright (C) 2025 Ultra Librarian. All rights reserved.; Design Item ID: AP63205WU-7
U11#2 = CMP-031-00010-2: Linear Voltage Regulator IC Positive Fixed 1 Output 1A TO-252, 1.6V @ 1A, 100 A, 60dB ~ 40dB , -40C ~ 125C (TJ); Manufacturer_Part_Number: TLV76133KVUR; Manufacturer_Name: Texas Instruments; Geometry.Height: 2.65mm; Output Voltage: 5V; Min Supply Voltage: 2.5V; Max Supply Voltage: 18V; Min Operating Temperature: -40°C; Max Operating Temperature: 125°C; Output Current: 1A; Mouser Part Number: 595-TLV76150KVUR; Source: TLV76150KVUR.SchLib; Design Item ID: TLV76150KVUR
U12 = CMP-089-000000-2: 1-A, low-IQ high-accuracy low-dropout (LDO) voltage regulator with enable; MF: Texas Instruments; SnapEDA_Link: https://www.snapeda.com/parts/TLV75733PDBVR/Texas+Instruments/view-part/?ref=snap; Source: TLV75733PDBVR.SchLib; Package: SOT-23-5 Texas Instruments; Pin Count: 4; Design Item ID: TLV75733PDBVR; Check_prices: https://www.snapeda.com/parts/TLV75733PDBVR/Texas+Instruments/view-part/?ref=eda; Value: *; MP: TLV75733PDBVR; Component Type: Standard

## Sheet BMS_Logic.SchDoc
size 558 x 431 mm; SheetNumber: 4; SheetTotal: 5
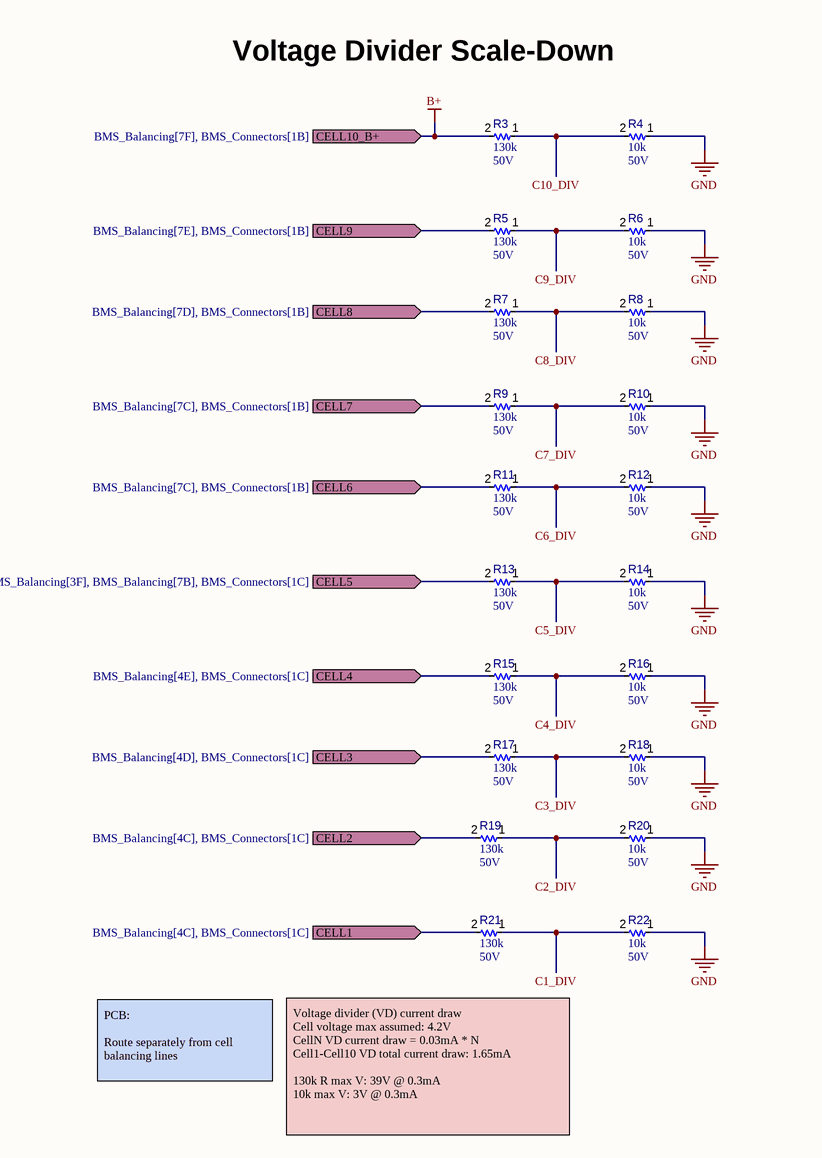
[diagram p3: BMS_Logic.SchDoc, top left]
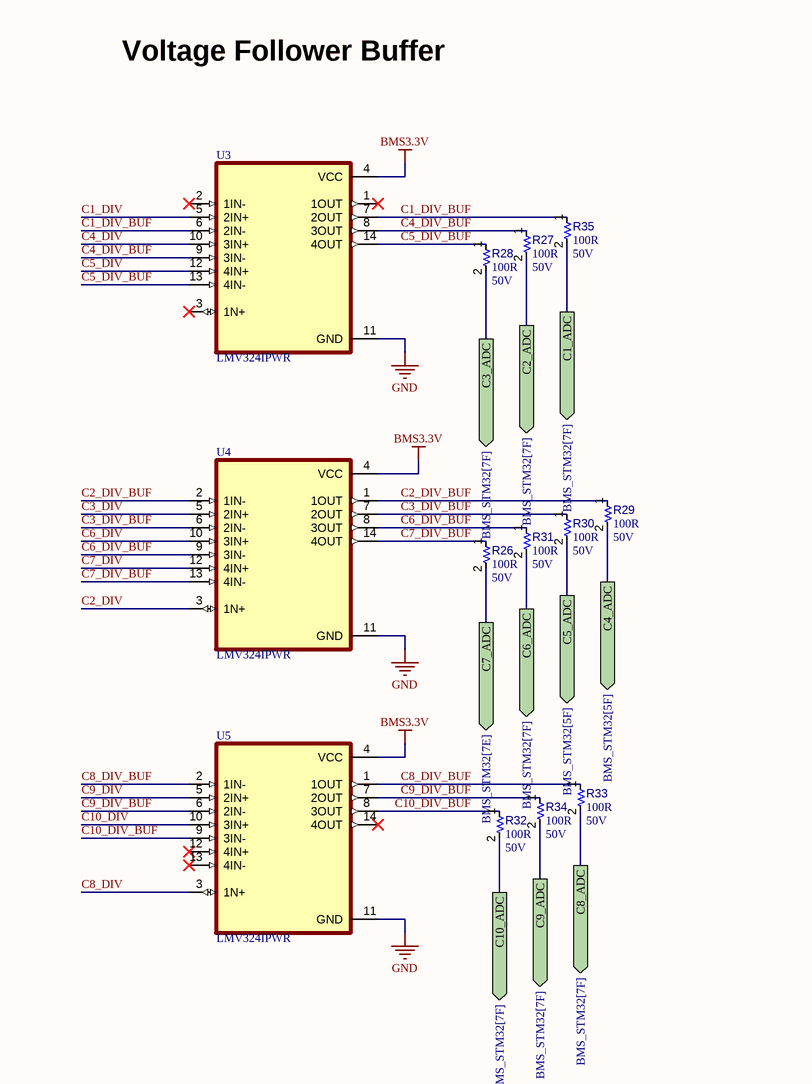
[diagram p4: BMS_Logic.SchDoc, top right]
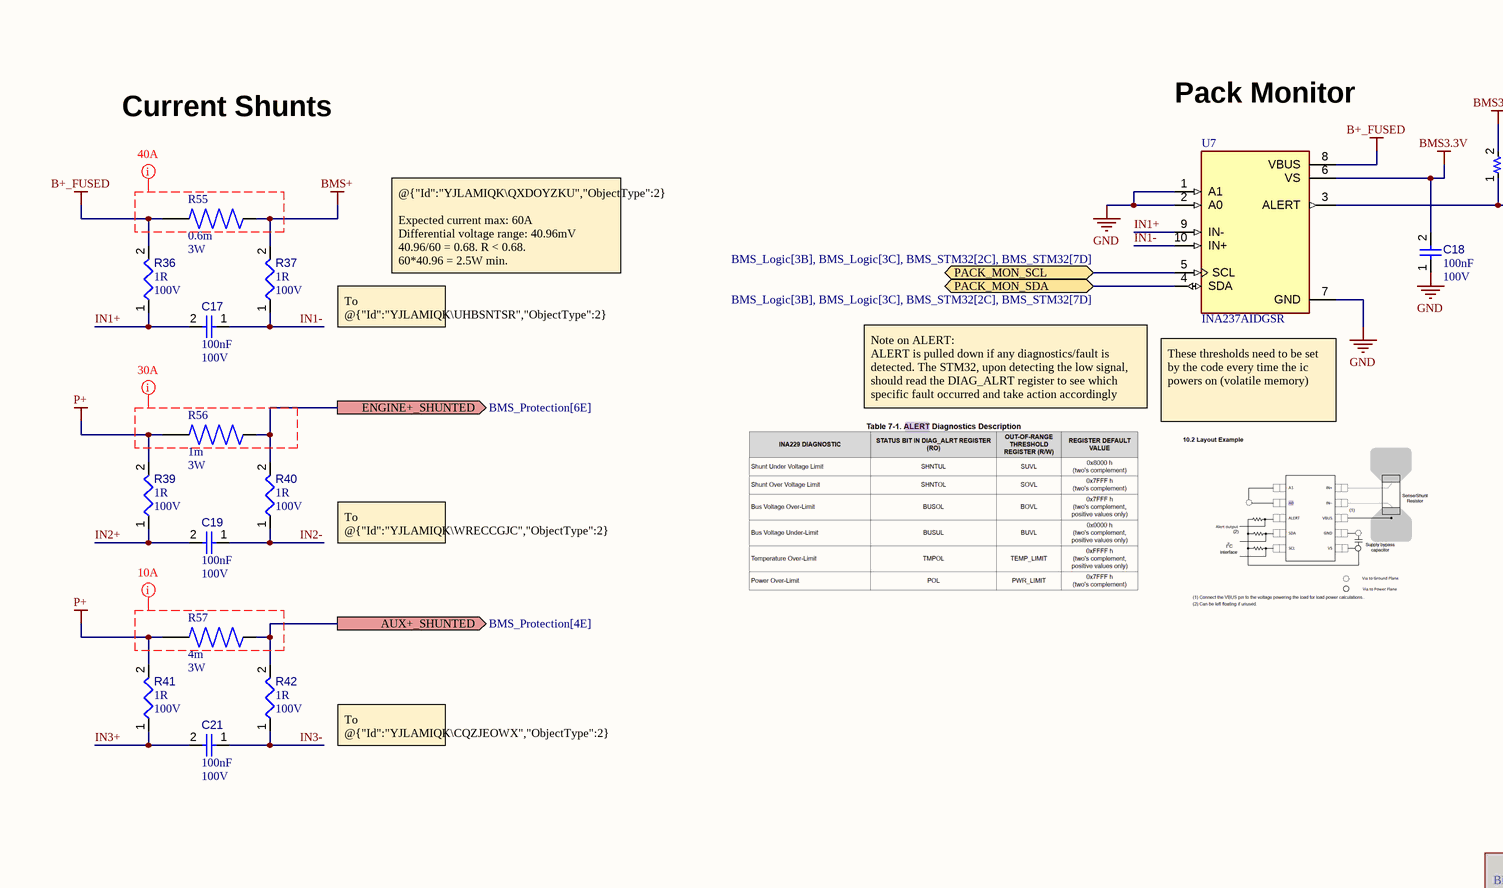
[diagram p5: BMS_Logic.SchDoc, bottom left]
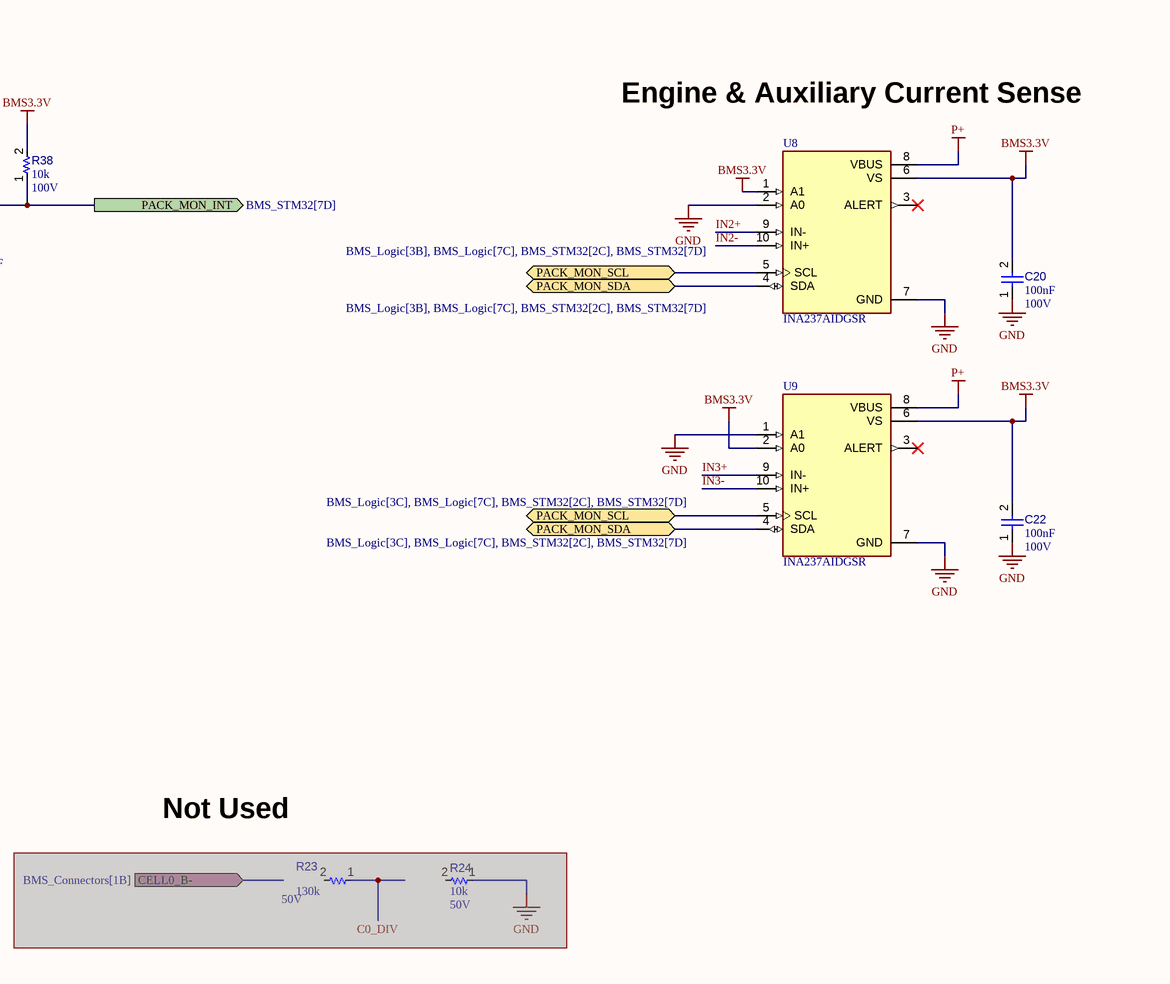
[diagram p6: BMS_Logic.SchDoc, bottom right]

### Parts
(Parts that share a designator on the sheet are numbered #1, #2 ... from top to bottom, then left to right.)
C17  value 100nF  Voltage Rating: 100V  [CAPC1608X90X40NL10T20]  (hidden comment: CC0603KRX7R0BB104)
C18  value 100nF  Voltage Rating: 100V  [CAPC1608X90X40NL10T20]  (hidden comment: CC0603KRX7R0BB104)
C19  value 100nF  Voltage Rating: 100V  [CAPC1608X90X40NL10T20]  (hidden comment: CC0603KRX7R0BB104)
C20  value 100nF  Voltage Rating: 100V  [CAPC1608X90X40NL10T20]  (hidden comment: CC0603KRX7R0BB104)
C21  value 100nF  Voltage Rating: 100V  [CAPC1608X90X40NL10T20]  (hidden comment: CC0603KRX7R0BB104)
C22  value 100nF  Voltage Rating: 100V  [CAPC1608X90X40NL10T20]  (hidden comment: CC0603KRX7R0BB104)
R3  value 130k  Voltage Rating: 50V  [RESC0402(1005)_L]  (hidden comment: RC0402FR-07130KL)
R4  value 10k  Voltage Rating: 50V  [RESC0402(1005)_L]  (hidden comment: RC0402FR-0710KL)
R5  value 130k  Voltage Rating: 50V  [RESC0402(1005)_L]  (hidden comment: RC0402FR-07130KL)
R6  value 10k  Voltage Rating: 50V  [RESC0402(1005)_L]  (hidden comment: RC0402FR-0710KL)
R7  value 130k  Voltage Rating: 50V  [RESC0402(1005)_L]  (hidden comment: RC0402FR-07130KL)
R8  value 10k  Voltage Rating: 50V  [RESC0402(1005)_L]  (hidden comment: RC0402FR-0710KL)
R9  value 130k  Voltage Rating: 50V  [RESC0402(1005)_L]  (hidden comment: RC0402FR-07130KL)
R10  value 10k  Voltage Rating: 50V  [RESC0402(1005)_L]  (hidden comment: RC0402FR-0710KL)
R11  value 130k  Voltage Rating: 50V  [RESC0402(1005)_L]  (hidden comment: RC0402FR-07130KL)
R12  value 10k  Voltage Rating: 50V  [RESC0402(1005)_L]  (hidden comment: RC0402FR-0710KL)
R13  value 130k  Voltage Rating: 50V  [RESC0402(1005)_L]  (hidden comment: RC0402FR-07130KL)
R14  value 10k  Voltage Rating: 50V  [RESC0402(1005)_L]  (hidden comment: RC0402FR-0710KL)
R15  value 130k  Voltage Rating: 50V  [RESC0402(1005)_L]  (hidden comment: RC0402FR-07130KL)
R16  value 10k  Voltage Rating: 50V  [RESC0402(1005)_L]  (hidden comment: RC0402FR-0710KL)
R17  value 130k  Voltage Rating: 50V  [RESC0402(1005)_L]  (hidden comment: RC0402FR-07130KL)
R18  value 10k  Voltage Rating: 50V  [RESC0402(1005)_L]  (hidden comment: RC0402FR-0710KL)
R19  value 130k  Voltage Rating: 50V  [RESC0402(1005)_L]  (hidden comment: RC0402FR-07130KL)
R20  value 10k  Voltage Rating: 50V  [RESC0402(1005)_L]  (hidden comment: RC0402FR-0710KL)
R21  value 130k  Voltage Rating: 50V  [RESC0402(1005)_L]  (hidden comment: RC0402FR-07130KL)
R22  value 10k  Voltage Rating: 50V  [RESC0402(1005)_L]  (hidden comment: RC0402FR-0710KL)
R23#1  value 130k  Voltage Rating: 50V  [RESC0402(1005)_L]  (hidden comment: RC0402FR-07130KL)  (masked out: inside a compile mask, not in the netlist)
R24#1  value 10k  Voltage Rating: 50V  [RESC0402(1005)_L]  (hidden comment: RC0402FR-0710KL)  (masked out: inside a compile mask, not in the netlist)
R26  value 100R  Voltage Rating: 50V  [RESC0402(1005)_L]  (hidden comment: RC0402FR-07100RL)
R27  value 100R  Voltage Rating: 50V  [RESC0402(1005)_L]  (hidden comment: RC0402FR-07100RL)
R28  value 100R  Voltage Rating: 50V  [RESC0402(1005)_L]  (hidden comment: RC0402FR-07100RL)
R29  value 100R  Voltage Rating: 50V  [RESC0402(1005)_L]  (hidden comment: RC0402FR-07100RL)
R30  value 100R  Voltage Rating: 50V  [RESC0402(1005)_L]  (hidden comment: RC0402FR-07100RL)
R31  value 100R  Voltage Rating: 50V  [RESC0402(1005)_L]  (hidden comment: RC0402FR-07100RL)
R32  value 100R  Voltage Rating: 50V  [RESC0402(1005)_L]  (hidden comment: RC0402FR-07100RL)
R33  value 100R  Voltage Rating: 50V  [RESC0402(1005)_L]  (hidden comment: RC0402FR-07100RL)
R34  value 100R  Voltage Rating: 50V  [RESC0402(1005)_L]  (hidden comment: RC0402FR-07100RL)
R35  value 100R  Voltage Rating: 50V  [RESC0402(1005)_L]  (hidden comment: RC0402FR-07100RL)
R36  value 1R  Voltage Rating: 100V  [RESC0805(2012)_L]  (hidden comment: RC0805FR-071RL)
R37  value 1R  Voltage Rating: 100V  [RESC0805(2012)_L]  (hidden comment: RC0805FR-071RL)
R38  value 10k  Voltage Rating: 100V  [RESC0402(1005)_L]  (hidden comment: ERJ2GEJ103X)
R39  value 1R  Voltage Rating: 100V  [RESC0805(2012)_L]  (hidden comment: RC0805FR-071RL)
R40  value 1R  Voltage Rating: 100V  [RESC0805(2012)_L]  (hidden comment: RC0805FR-071RL)
R41  value 1R  Voltage Rating: 100V  [RESC0805(2012)_L]  (hidden comment: RC0805FR-071RL)
R42  value 1R  Voltage Rating: 100V  [RESC0805(2012)_L]  (hidden comment: RC0805FR-071RL)
R55  value 0.6m  Power: 3W  [RESC6331X75N]  (hidden comment: HoSRX2512-3W-0.6m-0.5%)
R56  value 1m  Power: 3W  [RESC6331X75N]  (hidden comment: Milliohm HoJLR2512-3W-1mR-1%)
R57  value 4m  Power: 3W  [RESC6331X75N]  (hidden comment: Milliohm HoJLR2512-3W-4mR-1%)
U3  LMV324IPWR  [SOP65P640X120-14N]
U4  LMV324IPWR  [SOP65P640X120-14N]
U5  LMV324IPWR  [SOP65P640X120-14N]
U7  INA237AIDGSR  [SOP50P490X110-10N]
U8  INA237AIDGSR  [SOP50P490X110-10N]
U9  INA237AIDGSR  [SOP50P490X110-10N]

### Ports
AUX+_SHUNTED (out, see BMS_Protection[4E]), C1_ADC (out, see BMS_STM32[7F]), C2_ADC (out, see BMS_STM32[7F]), C3_ADC (out, see BMS_STM32[7F]), C4_ADC (out, see BMS_STM32[5F]), C5_ADC (out, see BMS_STM32[5F]), C6_ADC (out, see BMS_STM32[7F]), C7_ADC (out, see BMS_STM32[7E]), C8_ADC (out, see BMS_STM32[7F]), C9_ADC (out, see BMS_STM32[7F]), C10_ADC (out, see BMS_STM32[7F]), CELL0_B- (in, see BMS_Connectors[1B]), CELL1 (in, see BMS_Balancing[4C], BMS_Connectors[1C]), CELL2 (in, see BMS_Balancing[4C], BMS_Connectors[1C]), CELL3 (in, see BMS_Balancing[4D], BMS_Connectors[1C]), CELL4 (in, see BMS_Balancing[4E], BMS_Connectors[1C]), CELL5 (in, see BMS_Balancing[3F], BMS_Balancing[7B], BMS_Connectors[1C]), CELL6 (in, see BMS_Balancing[7C], BMS_Connectors[1B]), CELL7 (in, see BMS_Balancing[7C], BMS_Connectors[1B]), CELL8 (in, see BMS_Balancing[7D], BMS_Connectors[1B]), CELL9 (in, see BMS_Balancing[7E], BMS_Connectors[1B]), CELL10_B+ (in, see BMS_Balancing[7F], BMS_Connectors[1B]), ENGINE+_SHUNTED (out, see BMS_Protection[6E]), PACK_MON_INT (out, see BMS_STM32[7D]), PACK_MON_SCL (bidir, see BMS_Logic[3B], BMS_Logic[3C], BMS_STM32[2C], BMS_STM32[7D]), PACK_MON_SCL (bidir, see BMS_Logic[3B], BMS_Logic[7C], BMS_STM32[2C], BMS_STM32[7D]), PACK_MON_SCL (bidir, see BMS_Logic[3C], BMS_Logic[7C], BMS_STM32[2C], BMS_STM32[7D]), PACK_MON_SDA (bidir, see BMS_Logic[3B], BMS_Logic[3C], BMS_STM32[2C], BMS_STM32[7D]), PACK_MON_SDA (bidir, see BMS_Logic[3B], BMS_Logic[7C], BMS_STM32[2C], BMS_STM32[7D]), PACK_MON_SDA (bidir, see BMS_Logic[3C], BMS_Logic[7C], BMS_STM32[2C], BMS_STM32[7D])

### Nets
B+: R3.2 ; port CELL10_B+
B+_FUSED: R36.2 R55.1 U7.8(VBUS)
BMS3.3V: C18.2 C20.2 C22.2 R38.2 U3.4(VCC) U4.4(VCC) U5.4(VCC) U7.6(VS) U8.1(A1) U8.6(VS) U9.2(A0) U9.6(VS)
BMS+: R37.2 R55.2
GND: C18.1 C20.1 C22.1 R4.1 R6.1 R8.1 R10.1 R12.1 R14.1 R16.1 R18.1 R20.1 R22.1 U3.11(GND) U4.11(GND) U5.11(GND) U7.1(A1) U7.2(A0) U7.7(GND) U8.2(A0) U8.7(GND) U9.1(A1) U9.7(GND)
P+: R39.2 R41.2 R56.1 R57.1 U8.8(VBUS) U9.8(VBUS)
AUX+_SHUNTED: R42.2 R57.2 ; port AUX+_SHUNTED
C1_ADC: R35.2 ; port C1_ADC
C1_DIV: R21.1 R22.2 U3.5(2IN+)
C1_DIV_BUF: R35.1 U3.6(2IN-) U3.7(2OUT)
C2_ADC: R27.2 ; port C2_ADC
C2_DIV: R19.1 R20.2 U4.3(1N+)
C2_DIV_BUF: R29.1 U4.1(1OUT) U4.2(1IN-)
C3_ADC: R28.2 ; port C3_ADC
C3_DIV: R17.1 R18.2 U4.5(2IN+)
C3_DIV_BUF: R30.1 U4.6(2IN-) U4.7(2OUT)
C4_ADC: R29.2 ; port C4_ADC
C4_DIV: R15.1 R16.2 U3.10(3IN+)
C4_DIV_BUF: R27.1 U3.8(3OUT) U3.9(3IN-)
C5_ADC: R30.2 ; port C5_ADC
C5_DIV: R13.1 R14.2 U3.12(4IN+)
C5_DIV_BUF: R28.1 U3.13(4IN-) U3.14(4OUT)
C6_ADC: R31.2 ; port C6_ADC
C6_DIV: R11.1 R12.2 U4.10(3IN+)
C6_DIV_BUF: R31.1 U4.8(3OUT) U4.9(3IN-)
C7_ADC: R26.2 ; port C7_ADC
C7_DIV: R9.1 R10.2 U4.12(4IN+)
C7_DIV_BUF: R26.1 U4.13(4IN-) U4.14(4OUT)
C8_ADC: R33.2 ; port C8_ADC
C8_DIV: R7.1 R8.2 U5.3(1N+)
C8_DIV_BUF: R33.1 U5.1(1OUT) U5.2(1IN-)
C9_ADC: R34.2 ; port C9_ADC
C9_DIV: R5.1 R6.2 U5.5(2IN+)
C9_DIV_BUF: R34.1 U5.6(2IN-) U5.7(2OUT)
C10_ADC: R32.2 ; port C10_ADC
C10_DIV: R3.1 R4.2 U5.10(3IN+)
C10_DIV_BUF: R32.1 U5.8(3OUT) U5.9(3IN-)
CELL1: R21.2 ; port CELL1
CELL2: R19.2 ; port CELL2
CELL3: R17.2 ; port CELL3
CELL4: R15.2 ; port CELL4
CELL5: R13.2 ; port CELL5
CELL6: R11.2 ; port CELL6
CELL7: R9.2 ; port CELL7
CELL8: R7.2 ; port CELL8
CELL9: R5.2 ; port CELL9
ENGINE+_SHUNTED: R40.2 R56.2 ; port ENGINE+_SHUNTED
IN1+: C17.2 R36.1 U7.9(IN-)
IN1-: C17.1 R37.1 U7.10(IN+)
IN2+: C19.2 R39.1 U8.9(IN-)
IN2-: C19.1 R40.1 U8.10(IN+)
IN3+: C21.2 R41.1 U9.9(IN-)
IN3-: C21.1 R42.1 U9.10(IN+)
PACK_MON_INT: R38.1 U7.3(ALERT) ; port PACK_MON_INT
PACK_MON_SCL: U7.5(SCL) U8.5(SCL) U9.5(SCL) ; port PACK_MON_SCL
PACK_MON_SDA: U7.4(SDA) U8.4(SDA) U9.4(SDA) ; port PACK_MON_SDA

Not connected (* = marked no-connect by the designer): U3 1(1OUT)* 2(1IN-)* 3(1N+)*; U5 12(4IN+)* 13(4IN-)* 14(4OUT)*; U8 3(ALERT)*; U9 3(ALERT)*

### Layout directives
mark named 30A: (no net found under the mark)
mark named 40A: (no net found under the mark)
mark named 10A: (no net found under the mark)

### Notes on the sheet
- Voltage Divider Scale-Down
- Voltage Follower Buffer
- PCB:
  Route separately from cell balancing lines
- Voltage divider (VD) current draw
  Cell voltage max assumed: 4.2V
  CellN VD current draw = 0.03mA * N
  Cell1-Cell10 VD total current draw: 1.65mA
  130k R max V: 39V @ 0.3mA
  10k max V: 3V @ 0.3mA
- Pack Monitor
- Engine & Auxiliary Current Sense
- Current Shunts
- @{"Id":"YJLAMIQK\QXDOYZKU","ObjectType":2}
  Expected current max: 60A
  Differential voltage range: 40.96mV
  40.96/60 = 0.68. R < 0.68.
  60*40.96 = 2.5W min.
- To @{"Id":"YJLAMIQK\UHBSNTSR","ObjectType":2}
- Note on ALERT:
  ALERT is pulled down if any diagnostics/fault is detected. The STM32, upon detecting the low signal, should read the DIAG_ALRT register to see which specific fault occurred and take action accordingly
- (near U7) These thresholds need to be set by the code every time the ic powers on (volatile memory)
- To @{"Id":"YJLAMIQK\WRECCGJC","ObjectType":2}
- To @{"Id":"YJLAMIQK\CQZJEOWX","ObjectType":2}
- Not Used
- DWG. NO.
- REV.
- SHT.
- REVISION
- DESCRIPTION
- DATE
- APPROVED
- THIS DOCUMENT AND THE DATA DISCLOSED HEREIN OR HEREWITH IS THE PROPERTY OF ALTIUM LIMITED AND MAY BE FREELY DISTRIBUTED IN WHOLE. NO RIGHTS ARE RESERVED OR EXPRESS OR IMPLIED WARANTEE GIVEN.
- ENG:
- DSN:
- APPROVALS
- PROJECT
- DOCUMENT REVISION:
- DESIGN ITEM:
- CHK:
- BOM:
- REFERENCE DOCUMENTS
- PROJECT REVISION:
- TITLE
- FAB DWG:
- PCB DWG:
- ASSY DWG:
- SCALE:
- SIZE
- C
- CAGE CODE
- FILE NAME
- DWG NO.
- SHEET
- OF
- REV

### Library data of the parts
C17-C22 = CMP-001-00017-6: Chip Capacitor, 100 nF, +/- 10%, 50 V, 0603 (1608 Metric); Capacitor Type: Ceramic; Mounting Technology: SM; Case/Package: 0603; Pins: 2; RoHS Compliant: True; Min Operating Temperature: -55°C; Max Operating Temperature: 125°C; Tolerance: 10%
R3-R22 R23#1 R24#1 R26-R35 = CMP-009-00065-4: as R58 on sheet BMS_STM32; Mounting Technology: SMT; Case/Package: 0402; Pins: 2; Tolerance: 1%
R36 R37 R39-R42 = CMP-009-00118-3: Chip Resistor, 1 kOhms, +/-5%, 125 mW, -55 to 155 degC, 0805; Tolerance: 5%; Power: 125mW; Case/Package: 0805; Pins: 2; Min Operating Temperature: -55°C; Max Operating Temperature: 155°C
R38 = CMP-009-00065-4: 100R 0.063W 1% 0402 (1005 Metric)  SMD; Power: 100mW; Mounting Technology: SMT; Case/Package: 0402; Pins: 2; Tolerance: 1%
R55 = CMP-009-00180-1: 0 Ohms Jumper 1W Chip Resistor 2512 (6432 Metric) - Thick Film; MF: Bourns; Source: CR2512-J_-000ELF.SchLib; SnapEDA_Link: https://www.snapeda.com/parts/CR2512-J/-000ELF/Bourns/view-part/?ref=snap; MP: CR2512-J/-000ELF; Design Item ID: CR2512-J/-000ELF; Case/Package: 6331 Bourns; Check_prices: https://www.snapeda.com/parts/CR2512-J/-000ELF/Bourns/view-part/?ref=eda
R56 R57 = CMP-009-00180-1: MF: Bourns; Source: CR2512-J_-000ELF.SchLib; SnapEDA_Link: https://www.snapeda.com/parts/CR2512-J/-000ELF/Bourns/view-part/?ref=snap; MP: CR2512-J/-000ELF; Design Item ID: CR2512-J/-000ELF; Case/Package: 6331 Bourns; Check_prices: https://www.snapeda.com/parts/CR2512-J/-000ELF/Bourns/view-part/?ref=eda
U3-U5 = CMP-014-00002-2: Quad, 5.5-V, 1-MHz, RRO operational amplifier; MF: Texas Instruments; Max Supply Current: 1.16mA; Input Offset Voltage-Max: 7mV; Power Supplies: 3/5V; Common-mode Reject Ratio-Nom: 65dB; Voltage Gain-Min: 10000; Slew Rate: 1V/µs; Bias Current-Max (IIB) @25C: 250nA; Unity Gain BW-Nom: 1MHz; Frequency Compensation: YES; Channels: 4; Supply Voltage Limit-Max: 5.5V; Architecture: VOLTAGE-FEEDBACK; Nominal Supply Voltage: 2.7V; Source: LMV324IPWR.SchLib; Value: *; SnapEDA_Link: https://www.snapeda.com/parts/LMV324IPWR/Texas+Instruments/view-part/?ref=snap; Pins: 14; Check_prices: https://www.snapeda.com/parts/LMV324IPWR/Texas+Instruments/view-part/?ref=eda; MP: LMV324IPWR; Component Type: Standard; Design Item ID: LMV324IPWR; Case/Package: TSSOP; Amplifier Type: OPERATIONAL AMPLIFIER; Peak Reflow Temperature (Cel): 260°C; RoHS Compliant: Yes; Height - Seated (Max): 1.2mm; Max Operating Temperature: 125°C; Surface Mount: Yes; Average Bias Current-Max (IIB): 250nA; Width: 4.4mm; Min Operating Temperature: -40°C; Length: 5mm; Temperature Grade: AUTOMOTIVE
U7-U9 = CMP-127-000000-1: 85-V, 16-bit, I2C output current/voltage/power monitor with alert; MF: Texas Instruments; MP: INA237AIDGSR; Value: *; Component Type: Standard; Design Item ID: INA237AIDGSR; SnapEDA_Link: https://www.snapeda.com/parts/INA237AIDGSR/Texas+Instruments/view-part/?ref=snap; Pin Count: 10; Package: VSSOP-10 Texas Instruments; Check_prices: https://www.snapeda.com/parts/INA237AIDGSR/Texas+Instruments/view-part/?ref=eda; Source: INA237AIDGSR.SchLib